# EAGLE design prese_sonde (EAGLE 4.16)
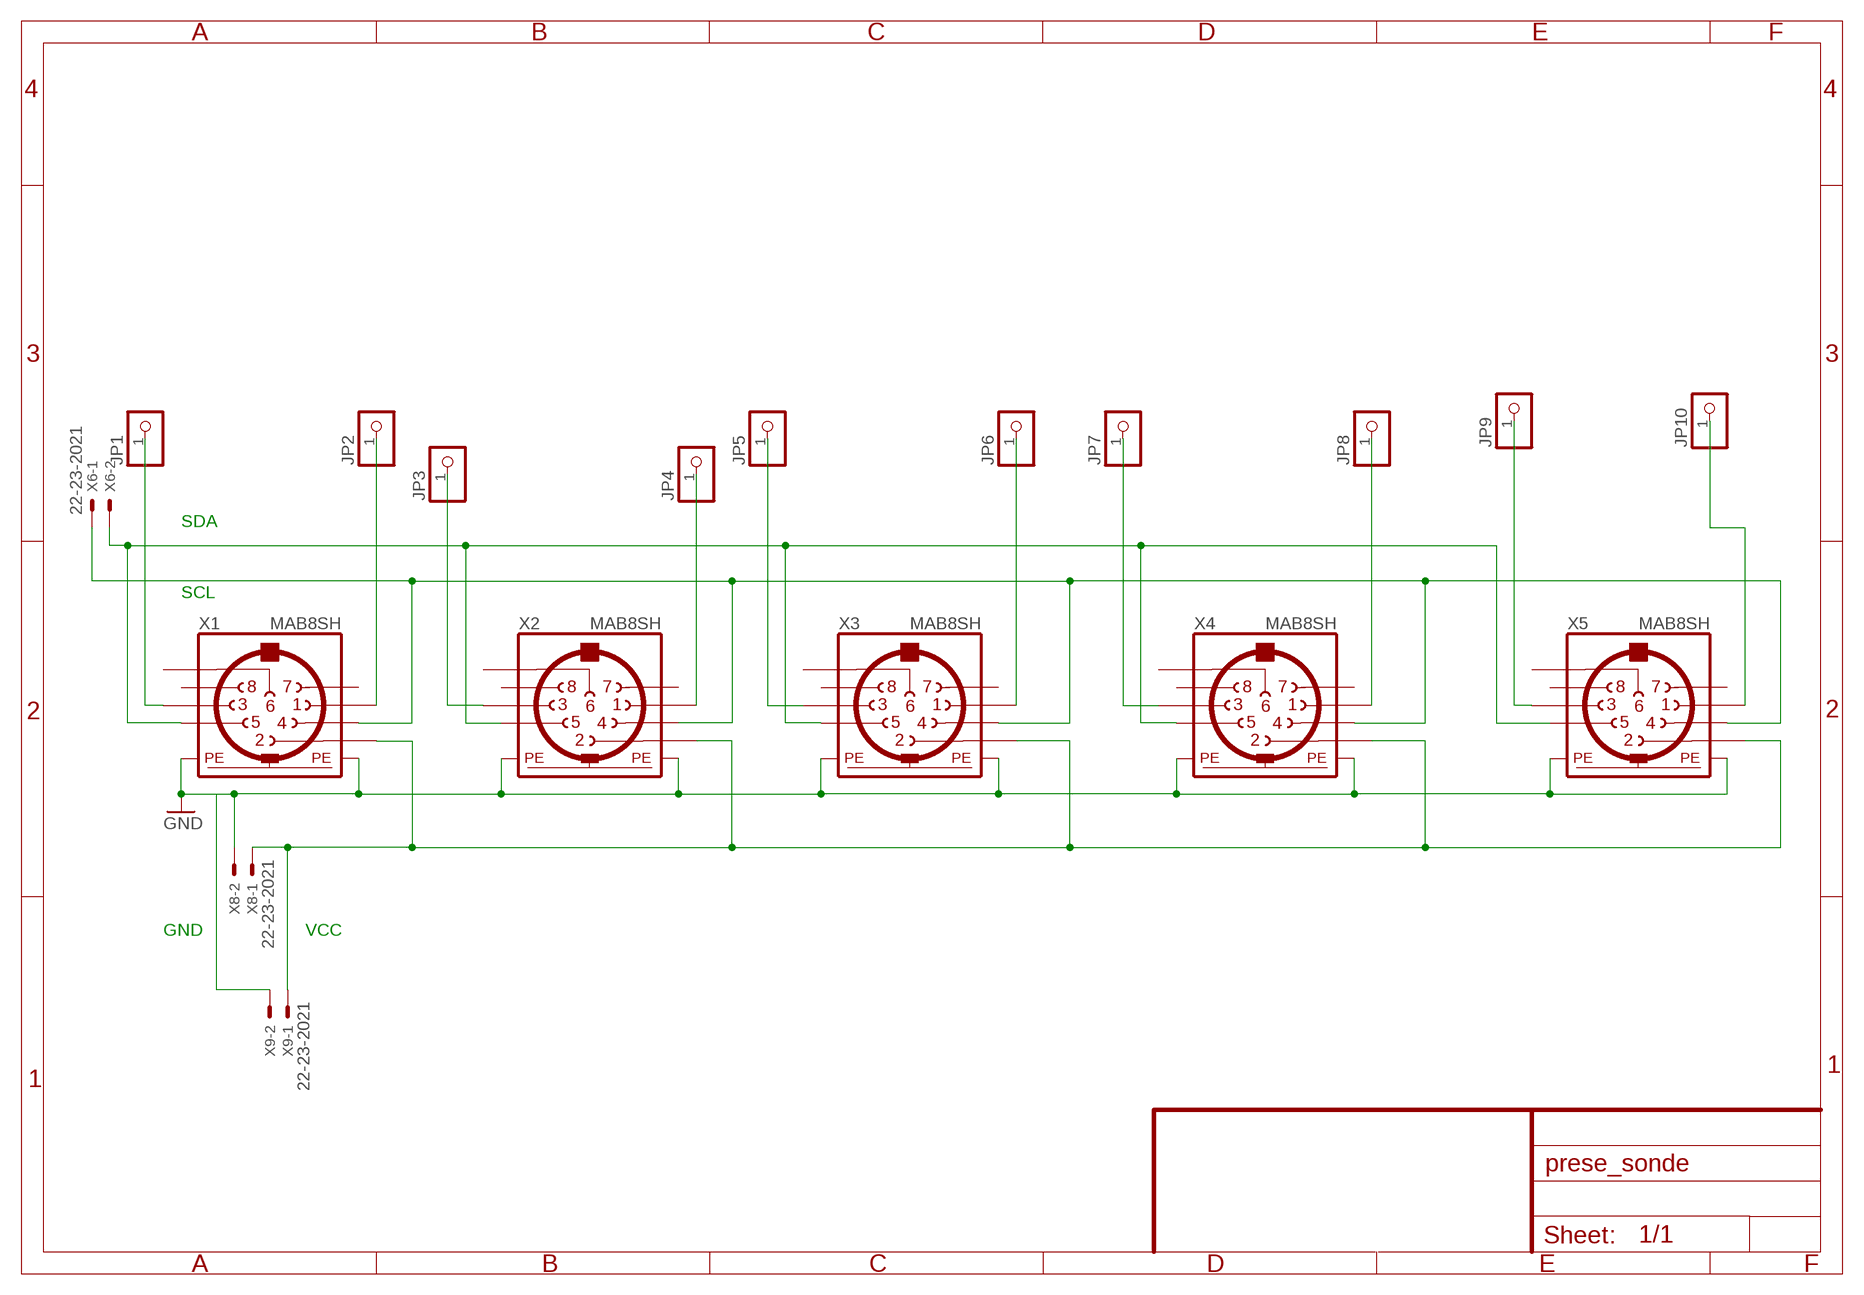
[diagram p0: schematic, sheet 1]

## Parts
JP1  PINHD-1X1  [1X01]
JP2  PINHD-1X1  [1X01]
JP3  PINHD-1X1  [1X01]
JP4  PINHD-1X1  [1X01]
JP5  PINHD-1X1  [1X01]
JP6  PINHD-1X1  [1X01]
JP7  PINHD-1X1  [1X01]
JP8  PINHD-1X1  [1X01]
JP9  PINHD-1X1  [1X01]
JP10  PINHD-1X1  [1X01]
X1  MAB8SH  [MAB8SH]
X2  MAB8SH  [MAB8SH]
X3  MAB8SH  [MAB8SH]
X4  MAB8SH  [MAB8SH]
X5  MAB8SH  [MAB8SH]
X6  22-23-2021  [22-23-2021]
X8  22-23-2021  [22-23-2021]
X9  22-23-2021  [22-23-2021]

## Nets
GND: X1.PE X1.PE@(PE) X2.PE X2.PE@(PE) X3.PE X3.PE@(PE) X4.PE X4.PE@(PE) X5.PE X5.PE@(PE) X8.2 X9.2
N$1: X1.2 X2.2 X3.2 X4.2 X5.2 X8.1 X9.1
N$2: JP2.1 X1.1
N$3: JP4.1 X2.1
N$4: JP6.1 X3.1
N$5: X1.5 X2.5 X3.5 X4.5 X5.5 X6.2
N$7: X1.4 X2.4 X3.4 X4.4 X5.4 X6.1
N$8: JP8.1 X4.1
N$10: JP1.1 X1.3
N$11: JP5.1 X3.3
N$12: JP3.1 X2.3
N$13: JP7.1 X4.3
N$14: JP9.1 X5.3
N$16: JP10.1 X5.1
Unconnected: X1.6 X1.7 X1.8 X2.6 X2.7 X2.8 X3.6 X3.7 X3.8 X4.6 X4.7 X4.8 X5.6 X5.7 X5.8

## Notes on the sheet
- SDA
- SCL
- GND | VCC

## Library data of the parts
JP1-JP10 = pinhead:PINHD-1X1: PIN HEADER
X1-X5 = con-hirschmann:MAB8SH: Female CONNECTOR 8 pins with shield, horizontal (DIN 41524)
X6 X8 X9 = con-molex:22-23-2021: .100" (2.54mm) Center Header - 2 Pin

## Board
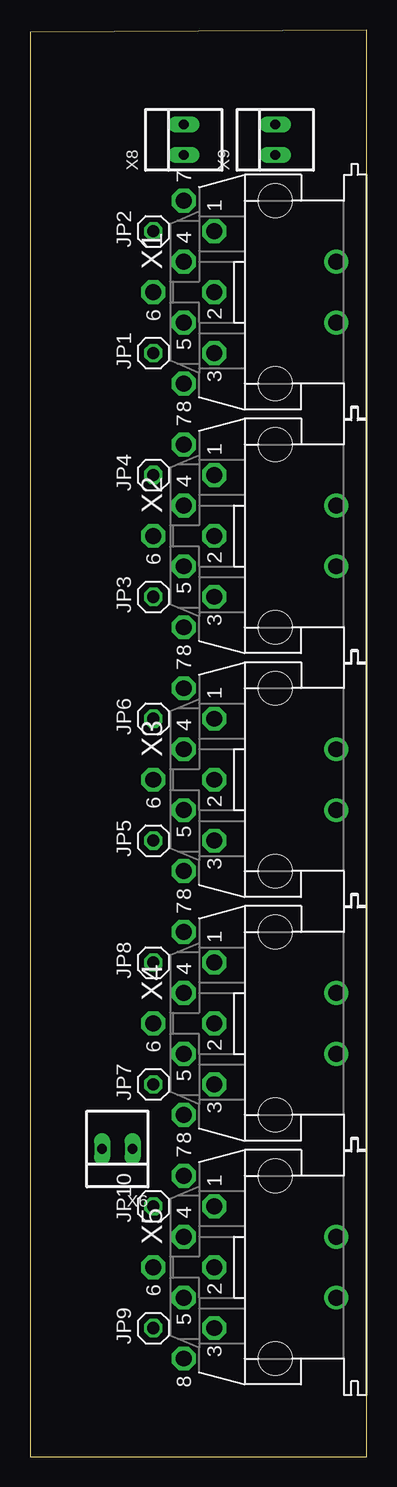
[diagram p1: board, top side]
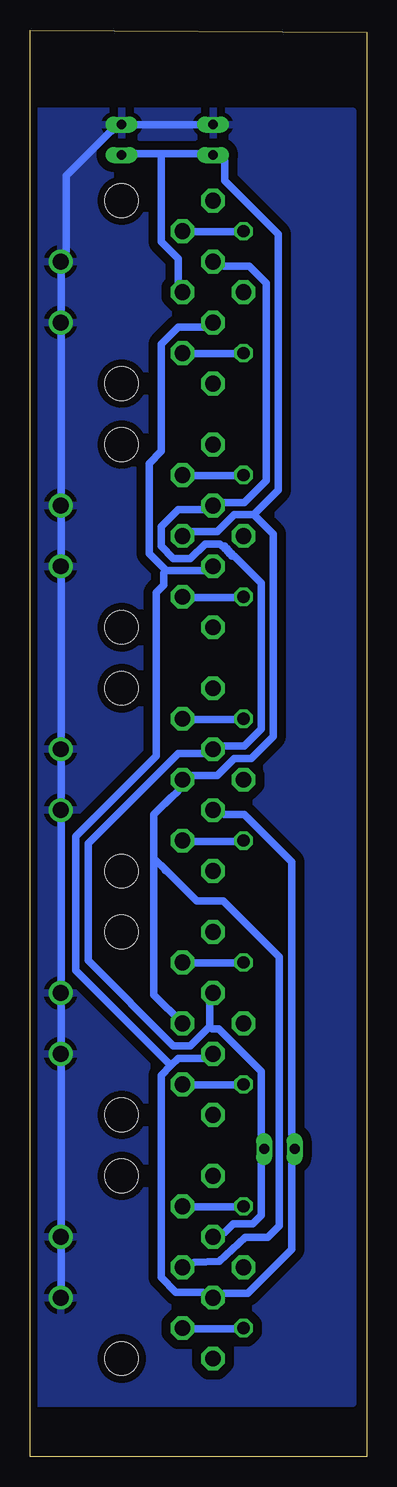
[diagram p2: board, bottom side, seen from below]

Size 28.07 x 118.95 mm. Coordinates in mm from the lower left corner, seen from the top.
Outline: 28.07,0 28.07,118.95 0,118.75 0,0 28.07,0
Copper layers (1*16): Top 0.035mm / dielectric 1.5mm / Bottom 0.035mm
Design rules "mio": minimum track width 24mil, minimum drill 24mil, track to track 30mil, track to pad 30mil, pad to pad 30mil, via to via 30mil, smd to smd 16mil, copper to edge 24mil, drill to drill 16mil, minimum pad ring 10mil, minimum via ring 8mil, stop-mask expansion 16mil, vias tented up to drill 0mil, thermal gap 16mil

### Footprints (pad centres in the part's own frame; a part is rotated, then mirrored left to right if it is on the bottom)
1X01 = drill 1.016 octagon: 1 0,0
MAB8SH = drill 1.321 octagon: 1 5.08,5.08; 2 0,5.08; 3 -5.08,5.08; 4 2.54,7.62; 5 -2.54,7.62; 6 0,10.16; 7 7.62,7.62; 8 -7.62,7.62 | drill 1.321 round: PE -2.54,-5.08; PE@ 2.54,-5.08 | hole 2.794: -7.62,0; 7.62,0
22-23-2021 = drill 0.813 long: 1 -1.27,0; 2 1.27,0

### Placement (x,y rotation side)
JP1  10.27,92.02 90 top
JP2  10.27,102.18 90 top
JP3  10.27,71.7 90 top
JP4  10.27,81.86 90 top
JP5  10.27,51.38 90 top
JP6  10.27,61.54 90 top
JP7  10.27,31.06 90 top
JP8  10.27,41.22 90 top
JP9  10.27,10.74 90 top
JP10  10.27,20.9 90 top
X1  20.43,97.1 90 top
X2  20.43,76.78 90 top
X3  20.43,56.46 90 top
X4  20.43,36.14 90 top
X5  20.43,15.82 90 top
X6  7.28,25.67 180 top
X8  12.81,109.8 90 top
X9  20.43,109.8 90 top

### Tracks (layer width: path | path; a pad name or v marks a point on that pad's centre or on a via)
GND
  Bottom 0.61: X8.2 X9.2 21.4,110.46 25.06,106.8 25.06,100.5 X1.PE@ 25.46,98.67 25.46,95.42 X1.PE 25.46,93.59 25.46,80.18 X2.PE@ 25.46,78.35 25.46,75.1 X2.PE 25.46,73.27 25.46,59.86 X3.PE@ 25.46,58.03 25.46,54.78 X3.PE 25.46,52.95 25.46,39.54 X4.PE@ 25.46,37.71 25.46,34.46 X4.PE 25.46,32.63 25.46,19.22 X5.PE@ 25.46,17.39 25.46,14.14 X5.PE
  pour Bottom: 27.39,4.49 27.39,112.19 1.18,112.19 1.18,4.49
N$1
  Bottom 0.61: 17.13,108.63 14.08,108.63 X8.1 11.85,108.02 11.85,106.4 7.38,101.93 7.38,80.59 9.41,78.56 | 17.13,108.63 19.16,108.63 X9.1 | X1.2 15.71,98.06 15.71,99.89 17.13,101.32 17.13,108.63 | 9.41,78.56 11.04,78.56 12.46,77.13 14.49,77.13 X2.2 | 9.41,78.56 7.78,76.93 7.78,60.07 9.61,58.24 11.04,58.24 12.46,56.81 14.49,56.81 X3.2 15.76,55.49 16.29,54.96 | 16.29,54.96 16.78,54.48 | X5.2 14.39,16.23 12.31,16.33 10.12,18.31 8.24,18.31 7.28,19.27 7.28,41.68 11.95,46.35 14.19,46.35 16.73,48.89 | 16.73,48.89 16.78,48.89 | X4.2 17.74,38.53 17.74,49.91 | 16.29,54.96 16.32,54.99 17.74,53.56 17.74,49.91 | 16.73,48.89 17.74,49.91
N$2
  Bottom 0.61: JP2.1 10.83,102.13 14.49,102.13 X1.1
N$3
  Bottom 0.61: JP4.1 10.83,81.81 14.49,81.81 X2.1
N$4
  Bottom 0.61: JP6.1 10.83,61.49 14.49,61.49 X3.1
N$5
  Bottom 0.61: 16.73,73.88 13.68,73.88 X2.5 | 16.73,73.88 18.15,75.31 18.15,82.82 17.13,83.84 17.13,92.78 15.71,94.2 13.68,94.2 X1.5 | 16.32,32.63 15.71,33.24 13.68,33.24 X4.5 | 16.32,32.63 17.13,31.82 17.13,14.96 15.91,13.74 13.68,13.74 X5.5 11.85,13.63 9.92,13.63 6.26,17.29 6.26,24.4 X6.2 6.26,26.94 6.26,49.6 10.22,53.56 11.85,53.56 X3.5 | 16.73,73.88 16.93,73.68 16.93,72.66 17.54,72.05 17.54,58.44 24.24,51.73 24.24,40.56 16.32,32.63
N$7
  Bottom 0.61: X1.4 11.85,99.28 9.82,99.28 8.39,97.86 8.39,81.4 10.22,79.57 11.85,79.57 X2.4 13.68,78.96 15.71,78.96 17.13,77.54 17.13,75.92 16.12,74.9 14.69,74.9 13.48,76.12 12.26,76.12 12.05,75.92 11.85,75.92 11.85,75.71 11.65,75.71 11.65,75.51 11.44,75.51 11.44,75.31 11.24,75.31 11.24,75.1 11.04,75.1 8.8,72.87 8.8,60.68 10.22,59.25 11.85,59.25 X3.4 13.68,58.64 15.71,58.64 23.23,51.13 23.23,41.37 16.12,34.26 14.69,34.26 13.07,35.89 | 13.07,35.89 13.07,37.71 X4.4 | X5.4 11.85,18.71 11.14,19.43 9.51,19.43 8.8,20.14 8.8,24.4 X6.1 8.8,26.94 8.8,32.13 12.36,35.68 12.87,35.68 13.07,35.89
N$8
  Bottom 0.61: JP8.1 10.83,41.17 14.49,41.17 X4.1
N$10
  Bottom 0.61: JP1.1 10.83,91.97 14.49,91.97 X1.3
N$11
  Bottom 0.61: JP5.1 10.83,51.33 14.49,51.33 X3.3
N$12
  Bottom 0.61: JP3.1 10.83,71.65 14.49,71.65 X2.3
N$13
  Bottom 0.61: JP7.1 10.83,31.01 14.49,31.01 X4.3
N$14
  Bottom 0.61: JP9.1 10.83,10.69 14.49,10.69 X5.3
N$16
  Bottom 0.61: JP10.1 10.83,20.85 14.49,20.85 X5.1